# Altium schematic sheet BottomBoard.SchDoc: Bottom Board
size A4; SheetNumber: 1; SheetTotal: 1
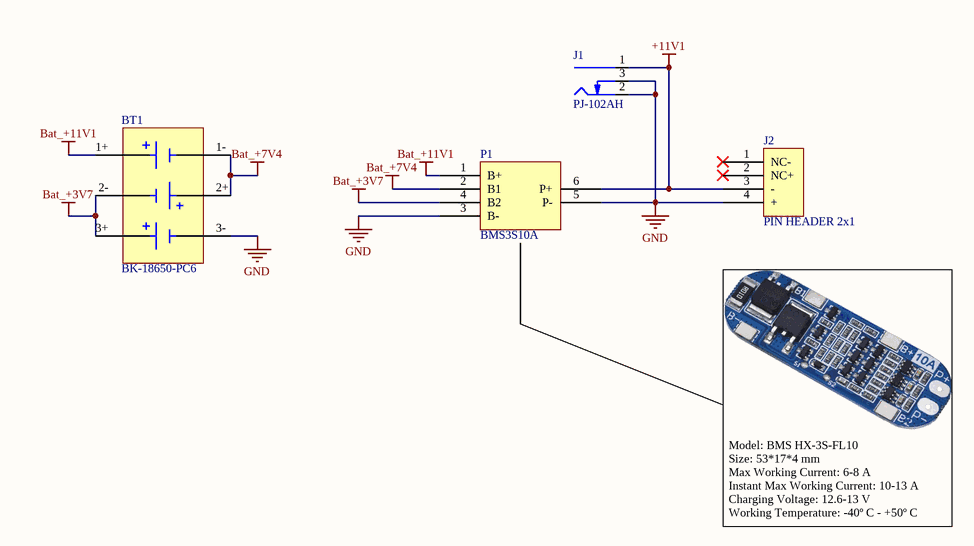
[diagram p0: BottomBoard.SchDoc]

## Parts
BT1  BK-18650-PC6  [BAT_BK-18650-PC6]
J1  PJ-102AH  [CUI PJ-102AH]
J2  PIN HEADER 2x1  [M20-9950245]
P1  BMS3S10A  [BMS]

## Nets
+11V1: J1.1(Centre) J2.3(-) P1.6(P+)
Bat_+3V7: BT1.2- BT1.3+ P1.4(B2)
Bat_+7V4: BT1.1- BT1.2+ P1.2(B1)
Bat_+11V1: BT1.1+ P1.1(B+)
GND: BT1.3- J1.2(Outer) J1.3(SW) J2.4(+) P1.3(B-) P1.5(P-)

Not connected (* = marked no-connect by the designer): J2 1(NC-)* 2(NC+)*

## Notes on the sheet
- Model: BMS HX-3S-FL10
  Size: 53*17*4 mm
  Max Working Current: 6-8 A
  Instant Max Working Current: 10-13 A
  Charging Voltage: 12.6-13 V
  Working Temperature: -40º C - +50º C
- Designer's signature
- Sheet title:
- Supervisor's signature
- Project title:
- Desginer:
- Tecnologías de Circuitos Impresos
  Grado en Ingeniería de Tecnologías de Telecomunicación
  ETSIIT. University of Granada
  C/ Periodista Daniel Saucedo Aranda, s/n, 18014, Granada, Granada, Spain
- Date:
- Revision:
- Sheet
- of

## Library data of the parts
BT1 = BK-18650-PC6: Battery Holder _Open_ 18650 3 Cell PC Pin; MF: MPD; Price: None; Package: None; Availability: Unavailable; SnapEDA_Link: https://www.snapeda.com/parts/BK-18650-PC6/MPD/view-part/4480464/?ref=snap; Value: *; MP: BK-18650-PC6
J1 = PJ-102AH: CONN PWR JACK 2X5.5MM SOLDER; Manufacturer: CUI Devices; Actual Diameter: 0.079" (2.00mm ID), 0.256" (6.50mm OD); Current Rating (Amps): 5A; Gender: Male; Industry Recognized Mating Diameter: 2.00mm ID (0.079"), 5.50mm OD (0.217"); Internal Switch(s): Single Switch, Normally Closed; Material Flammability Rating: UL94 V-0; Mating Length/Depth: 0.354" (9.00mm); Number of Positions/Contacts: 2 Conductors, 3 Contacts; Shielding: Unshielded; Voltage - Rated: 24VDC; Part Number: PJ-102AH; ComponentLink1Description: Datasheet; ComponentLink1URL: https://www.cuidevices.com/product/resource/digikeypdf/pj-102ah.pdf; ComponentLink2Description: DigiKey Link; ComponentLink2URL: //digikey.com/product-detail/en/cui-devices/PJ-102AH/CP-102AH-ND/408448; Connector Type: Jack; LastUpdated: 12/16/2019 19:01:27; Lifecycle Status: 0; Minimum Order: 1; Mounting Type: Through Hole, Right Angle; Packaging: Tray; Part Status: Active; Price: 0.76; Series: -; Supplier 1: DigiKey; Supplier Part Number 1: CP-102AH-ND; Termination: Solder
J2 = M20-9950245: M20-9950245 Pin Connector; ComponentLink1Description: Datasheet; ComponentLink1URL: https://www.snapeda.com/parts/M20-9950245/Harwin/datasheet/
P1 = BMS